# EAGLE design mapleshield-r1-v1 (EAGLE 5.01)
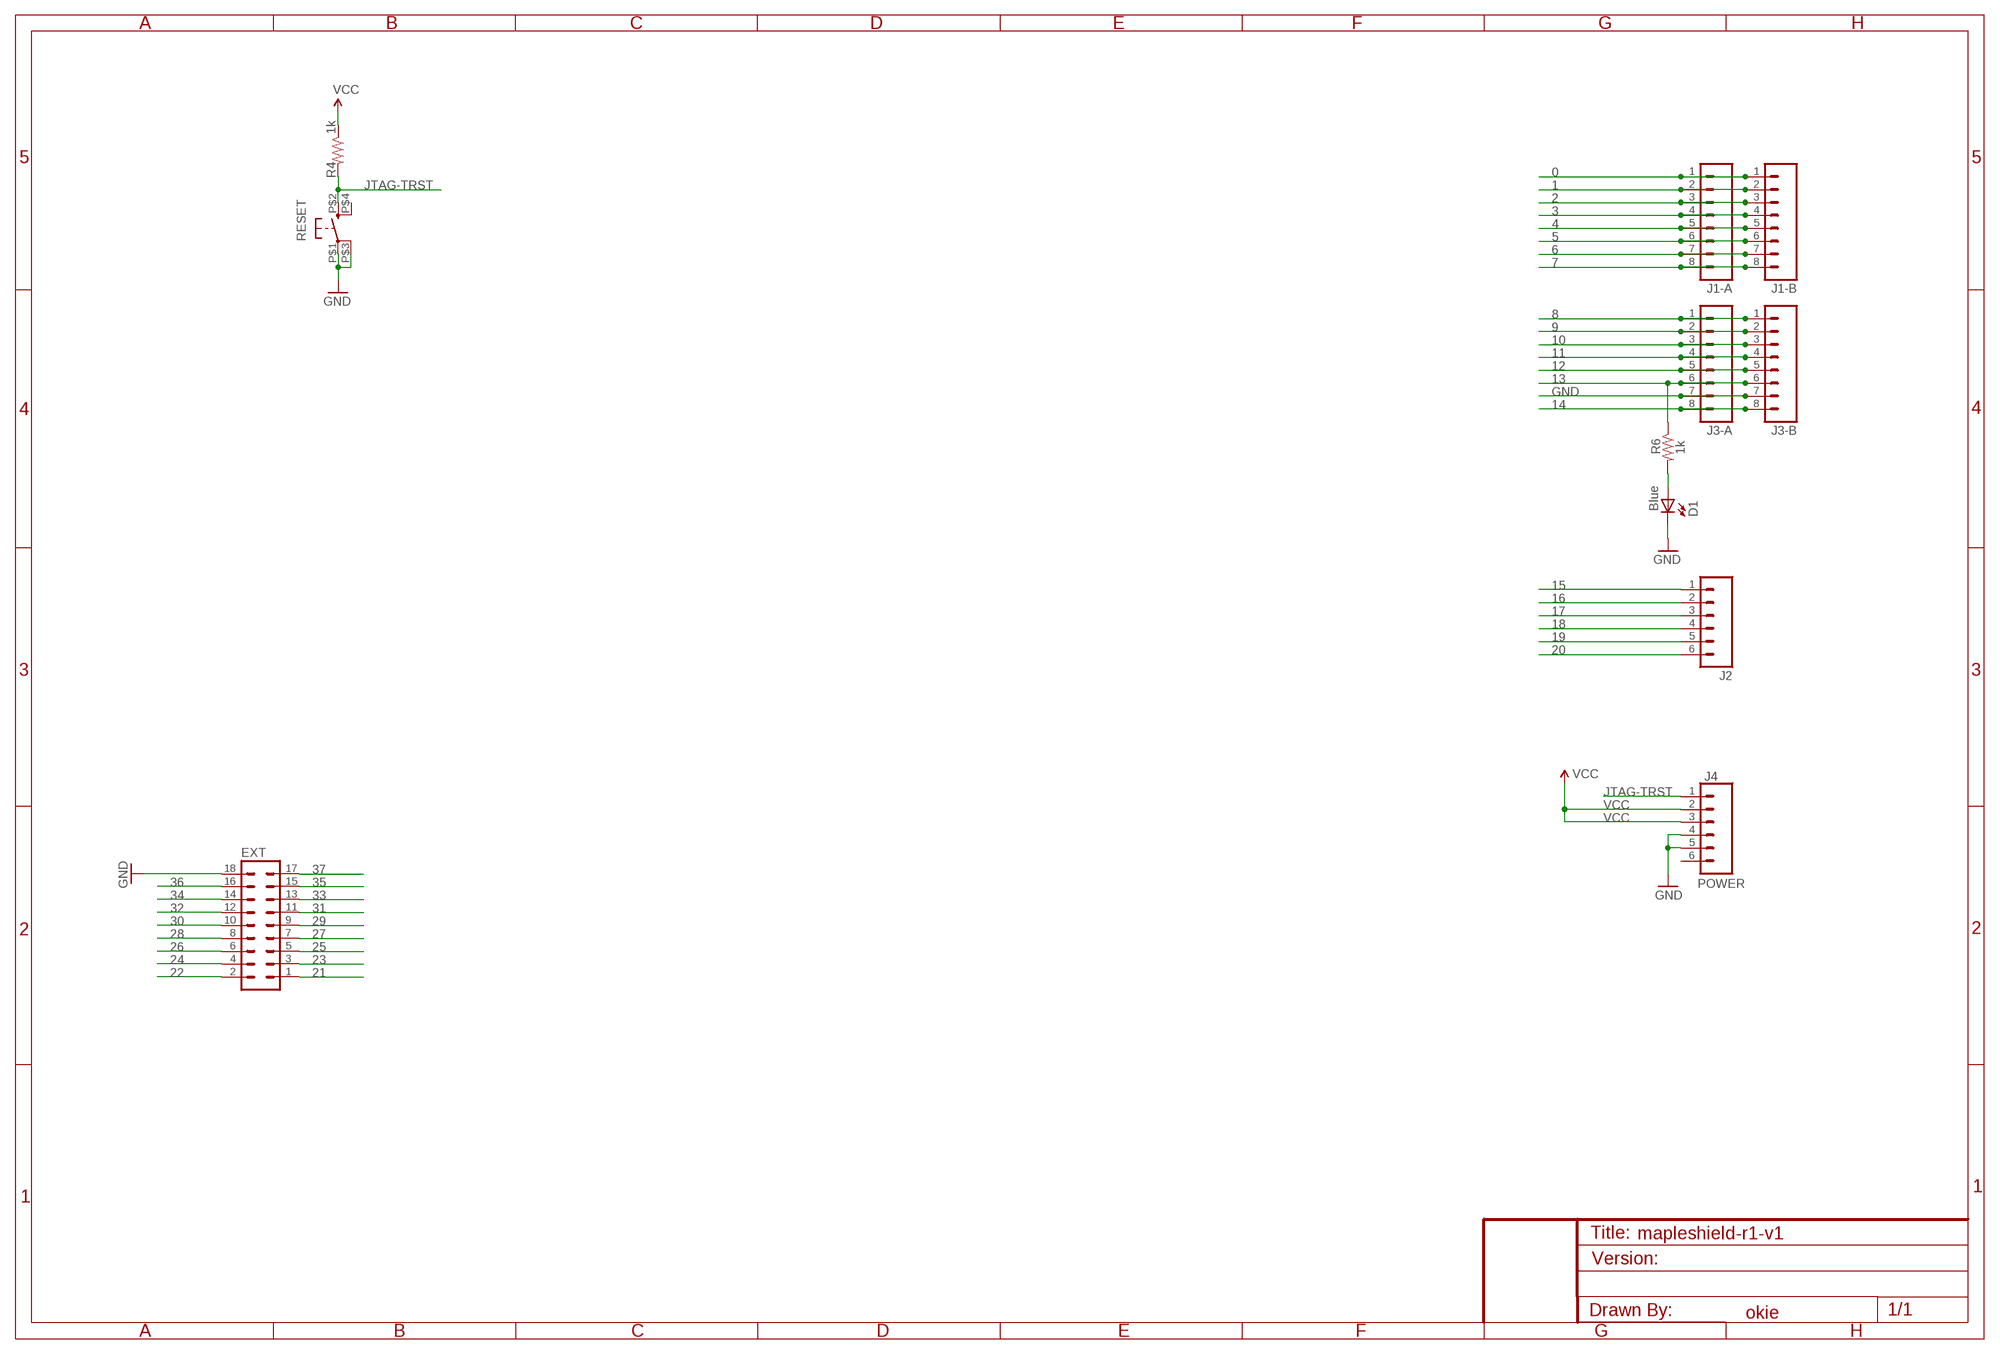
[diagram p0: schematic, sheet 1]

## Parts
D1  Blue  LED0603  [LED-0603]
EXT  MA09-2  [MA09-2]
J1-A  M08  [1X08]
J1-B  MA08-SQUARE  [1X08-SQUARE]
J2  M06SIP  [1X06]
J3-A  M08  [1X08]
J3-B  MA08-SQUARE  [1X08-SQUARE]
J4  POWER  M06SIP  [1X06]
R4  1k  RESISTOR0402  [C0402]
R6  1k  RESISTOR0402  [C0402]
RESET  BUTTON-KMR241GLFS  [PUSHBUTTON-KMR241GLFS]

## Nets
0: J1-A.1 J1-B.1
1: J1-A.2 J1-B.2
2: J1-A.3 J1-B.3
3: J1-A.4 J1-B.4
4: J1-A.5 J1-B.5
5: J1-A.6 J1-B.6
6: J1-A.7 J1-B.7
7: J1-A.8 J1-B.8
8: J3-A.1 J3-B.1
9: J3-A.2 J3-B.2
10: J3-A.3 J3-B.3
11: J3-A.4 J3-B.4
12: J3-A.5 J3-B.5
13: J3-A.6 J3-B.6 R6.1
14: J3-A.8 J3-B.8
15: J2.1
16: J2.2
17: J2.3
18: J2.4
19: J2.5
20: J2.6
21: EXT.1
22: EXT.2
23: EXT.3
24: EXT.4
25: EXT.5
26: EXT.6
27: EXT.7
28: EXT.8
29: EXT.9
30: EXT.10
31: EXT.11
32: EXT.12
33: EXT.13
34: EXT.14
35: EXT.15
36: EXT.16
37: EXT.17
GND [vcc]: D1.C EXT.18 J3-A.7 J3-B.7 J4.4 J4.5 RESET.P$1 RESET.P$3
JTAG-TRST: J4.1 R4.2 RESET.P$2
N$7: D1.A R6.2
VCC: J4.2 J4.3 R4.1
Unconnected: J4.6 RESET.P$4

## Notes on the sheet
- okie

## Library data of the parts
D1 = SparkFun:LED: LEDs Standard schematic elements and footprints for 5mm, 3mm, 1206, and 0603 sized LEDs. 5mm - Spark Fun Electronics SKU : COM-00529 (and others)
EXT = con-lstb:MA09-2: PIN HEADER
J1-A J3-A = SparkFun:M08: Header 8 Standard 8-pin 0.1" header. Use with straight break away headers (SKU : PRT-00116), right angle break away headers (PRT-00553), swiss pins (PRT-00743), machine pins (PRT-00117), and female headers (PRT-00115).
J1-B J3-B = SparkFun2:MA08-SQUARE
J2 J4 = SparkFun:M06: Header 6 Standard 6-pin 0.1" header. Use with straight break away headers (SKU : PRT-00116), right angle break away headers (PRT-00553), swiss pins (PRT-00743), machine pins (PRT-00117), and female headers (PRT-00115). Molex polarized connector foot print use with SKU : PRT-08094 with associated crimp pins and housings.
R4 R6 = SparkFun:RESISTOR: Resistor Basic schematic elements and footprints for 0603, 1206, and PTH 1/10th watt (small) resistors.
RESET = okie:BUTTON-KMR241GLFS

## Net classes
0 default: width 0.203 mm
1 vcc: width 0.254 mm
2 gnd: width 0.305 mm, drill 0.508 mm, clearance 0.152 mm
3 usbvcc: width 0.508 mm, drill 0.508 mm, clearance 0.152 mm

## Board
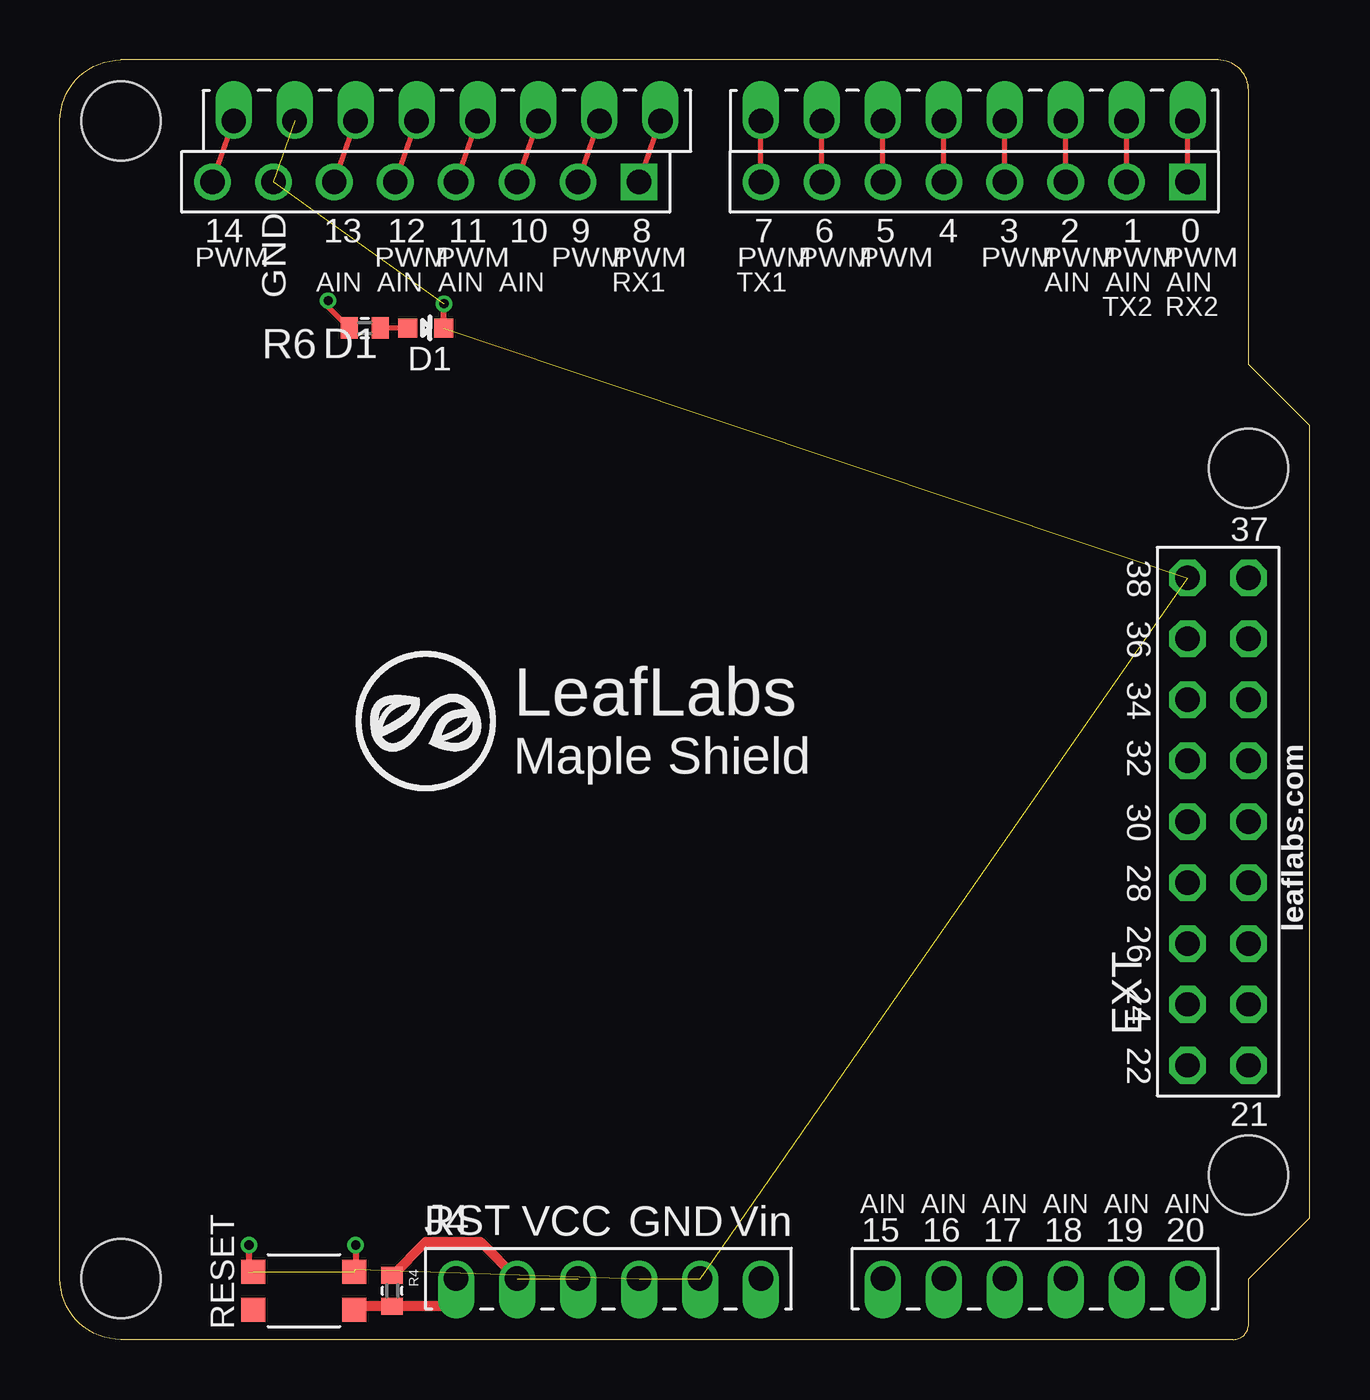
[diagram p1: board, top side]
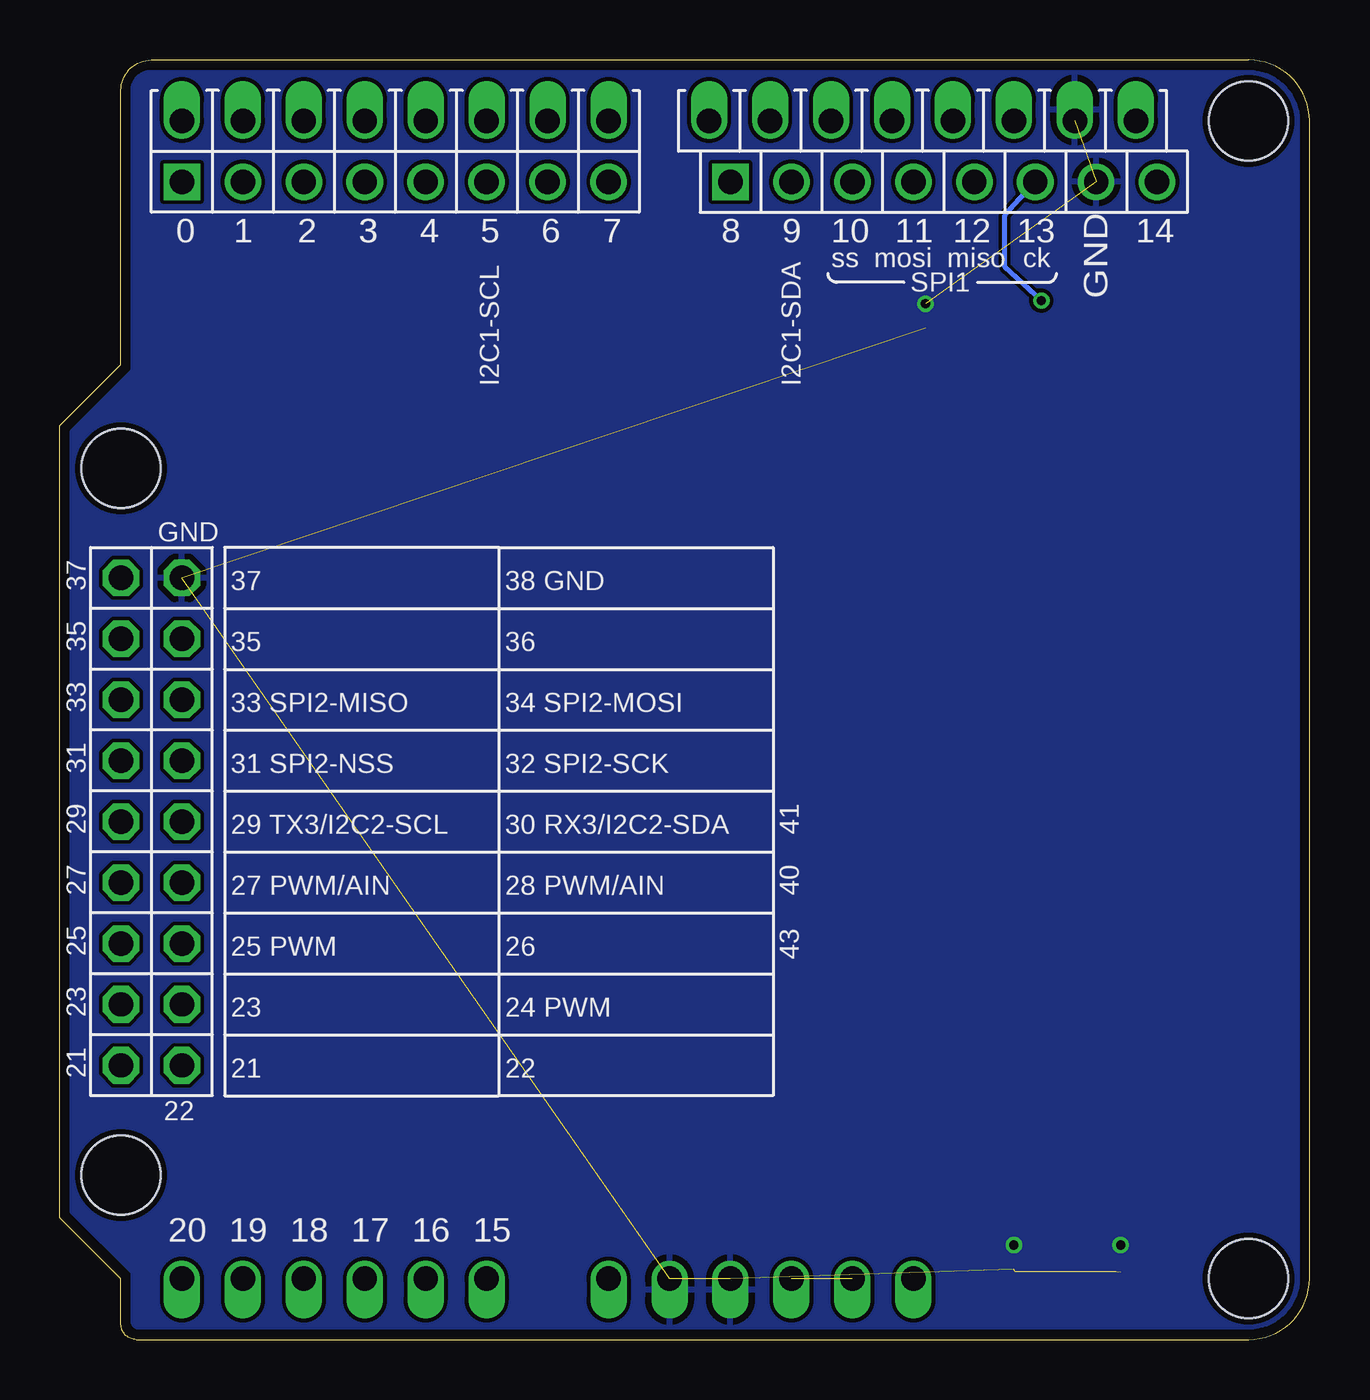
[diagram p2: board, bottom side, seen from below]

Size 52.07 x 53.34 mm. Coordinates in mm from the lower left corner, seen from the top.
Outline: 49.53,2.54 52.07,5.08 52.07,38.1 49.53,40.64 49.53,52.07 arc90 48.26,53.34 2.54,53.34 arc90 0,50.8 0,2.54 arc90 2.54,0 48.9,0 arc90 49.53,0.64 49.53,2.54
Copper layers (1*16): Top 0.035mm / dielectric 1.5mm / Bottom 0.035mm
Design rules "SparkFun *": minimum track width 6mil, minimum drill 15mil, track to track 6mil, track to pad 6mil, pad to pad 6mil, via to via 6mil, smd to smd 6mil, copper to edge 10mil, drill to drill 15mil, minimum pad ring 8mil, minimum via ring 6mil, stop-mask expansion 0mil, vias tented up to drill 20mil, thermal gap 10mil

### Footprints (pad centres in the part's own frame; a part is rotated, then mirrored left to right if it is on the bottom)
LED-0603 = smd 0.8 x 0.8: A 0,-0.75; C 0,0.75
MA09-2 = drill 1.016 octagon: 1 -10.16,-1.27; 2 -10.16,1.27; 3 -7.62,-1.27; 4 -7.62,1.27; 5 -5.08,-1.27; 6 -5.08,1.27; 7 -2.54,-1.27; 8 -2.54,1.27; 9 0,-1.27; 10 0,1.27; 11 2.54,-1.27; 12 2.54,1.27; 13 5.08,-1.27; 14 5.08,1.27; 15 7.62,-1.27; 16 7.62,1.27; 17 10.16,-1.27; 18 10.16,1.27
1X08 = drill 1.016 offset: 1 0,0; 2 2.54,0; 3 5.08,0; 4 7.62,0; 5 10.16,0; 6 12.7,0; 7 15.24,0; 8 17.78,0
1X08-SQUARE = drill 1.016 square: 1 -8.89,0 | drill 1.016 round: 2 -6.35,0; 3 -3.81,0; 4 -1.27,0; 5 1.27,0; 6 3.81,0; 7 6.35,0; 8 8.89,0
1X06 = drill 1.016 offset: 1 0,0; 2 2.54,0; 3 5.08,0; 4 7.62,0; 5 10.16,0; 6 12.7,0
C0402 = smd 0.7 x 0.9: 1 -0.65,0; 2 0.65,0
PUSHBUTTON-KMR241GLFS = smd 1 x 1: P$1 2.1,0.8; P$2 2.1,-0.8; P$3 -2.1,0.8; P$4 -2.1,-0.8
STAND-OFF = hole 3.302: 0,0

### Placement (x,y rotation side)
D1  15.24,42.16 270 top
EXT  48.26,21.59 90 top
J1-A  46.99,50.8 180 top
J1-B  38.1,48.26 180 top
J2  34.29,2.54 0 top
J3-A  25.02,50.8 180 top
J3-B  15.24,48.26 180 top
J4  16.51,2.54 0 top
R4  13.84,2.03 270 top
R6  12.7,42.16 0 top
RESET  10.16,2.03 0 top
U$1  STAND-OFF  [STAND-OFF]  2.54,2.54 0 top
U$2  STAND-OFF  [STAND-OFF]  49.53,36.32 0 top
U$4  STAND-OFF  [STAND-OFF]  2.54,50.8 0 top
U$10  STAND-OFF  [STAND-OFF]  49.53,6.86 0 top

### Tracks (layer width: path | path; a pad name or v marks a point on that pad's centre or on a via)
0
  Top 0.203: J1-B.1 J1-A.1 J1-B.1
1
  Top 0.203: J1-B.2 J1-A.2 J1-B.2
2
  Top 0.203: J1-B.3 J1-A.3 J1-B.3
3
  Top 0.203: J1-B.4 J1-A.4 J1-B.4
4
  Top 0.203: J1-B.5 J1-A.5 J1-B.5
5
  Top 0.203: J1-B.6 J1-A.6 J1-B.6
6
  Top 0.203: J1-B.7 J1-A.7
  Top 0.254: 31.77,48.23 31.77,48.21 | 31.77,48.23 31.78,48.23 | J1-B.7 31.77,48.23
7
  Top 0.203: J1-B.8 J1-A.8
8
  Top 0.203: J3-B.1 J3-A.1
9
  Top 0.203: J3-B.2 J3-A.2
10
  Top 0.203: J3-B.3 J3-A.3
11
  Top 0.203: J3-B.4 J3-A.4
12
  Top 0.203: J3-B.5 J3-A.5
13  (via drill 0.38)
  Top 0.203: R6.1 11.18,43.04 v11.18,43.31 | J3-B.6 J3-A.6
  Bottom 0.203: J3-B.6 12.7,46.86 12.7,44.7 v11.18,43.31
14
  Top 0.203: J3-B.8 J3-A.8
GND  (via drill 0.38)  (10 unrouted)
  Top 0.254: v7.87,3.94 7.87,2.79 | v12.32,3.94 12.32,2.92 | 16,42.16 v16,43.18
  pour Bottom: 2.54,52.83 arc90 0.51,50.8 0.51,2.54 arc90 2.54,0.51 48.77,0.51 arc90 49.02,0.76 49.02,2.79 51.56,5.33 51.56,37.85 49.02,40.39 49.02,52.07 arc90 48.26,52.83
JTAG-TRST
  Top 0.203: 16.51,1.78 J4.1 16.38,2.41 16.38,1.91 | 13.72,1.27 R4.2 13.97,1.27 | RESET.P$2 12.19,1.27
  Top 0.406: 13.83,1.4 13.72,1.4 | R4.2 13.83,1.4 | 16.38,1.91 15.88,1.4 13.83,1.4 | 12.1,1.4 12.06,1.4 | RESET.P$2 12.1,1.4 | 13.72,1.27 13.59,1.4 12.1,1.4
N$7
  Top 0.203: 13.59,41.92 R6.2 D1.A
VCC  (1 unrouted)
  Top 0.203: R4.1 14.11,2.68
  Top 0.406: J4.2 17.53,4.06 15.24,4.06 13.84,2.67 R4.1

### Text on the board
tPlace: 14 | GND | 13 | 12 | 11 | 10 | 9 | 8 | 7 | 6 | 5 | 4 | 3 | 2 | 1 | 0 | PWM | PWM | PWM | PWM | PWM | PWM | PWM | PWM | PWM | PWM | PWM | PWM | AIN | AIN | AIN | AIN | RX1 | TX1 | AIN | AIN | AIN | TX2 | RX2 | D1 | 38 | 37 | 36 | 34 | LeafLabs | 32 | Maple Shield | 30 | 28 | 26 | leaflabs.com | 24 | 22 | 21 | AIN | AIN | AIN | AIN | AIN | AIN | RST | VCC | GND | Vin | 15 | 16 | 17 | 18 | 19 | 20
bPlace: GND | 14 | 13 | 12 | 11 | 10 | 9 | 8 | 7 | 6 | 5 | 4 | 3 | 3 | 2 | 1 | 0 | ck | miso | mosi | ss | SPI1 | I2C1-SDA | I2C1-SCL | GND | 37 | 38 GND | 37 | 35 | 36 | 35 | 33 | 34 SPI2-MOSI | 33 SPI2-MISO | 31 | 32 SPI2-SCK | 31 SPI2-NSS | 41 | 29 | 30 RX3/I2C2-SDA | 29 TX3/I2C2-SCL | 40 | 27 | 28 PWM/AIN | 27 PWM/AIN | 43 | 25 | 26 | 25 PWM | 23 | 24 PWM | 23 | 21 | 22 | 21 | 22 | 15 | 16 | 17 | 18 | 19 | 20
tValues: DNP | DNP | DNP | DNP